# EAGLE design Glider (EAGLE 7.1.0)
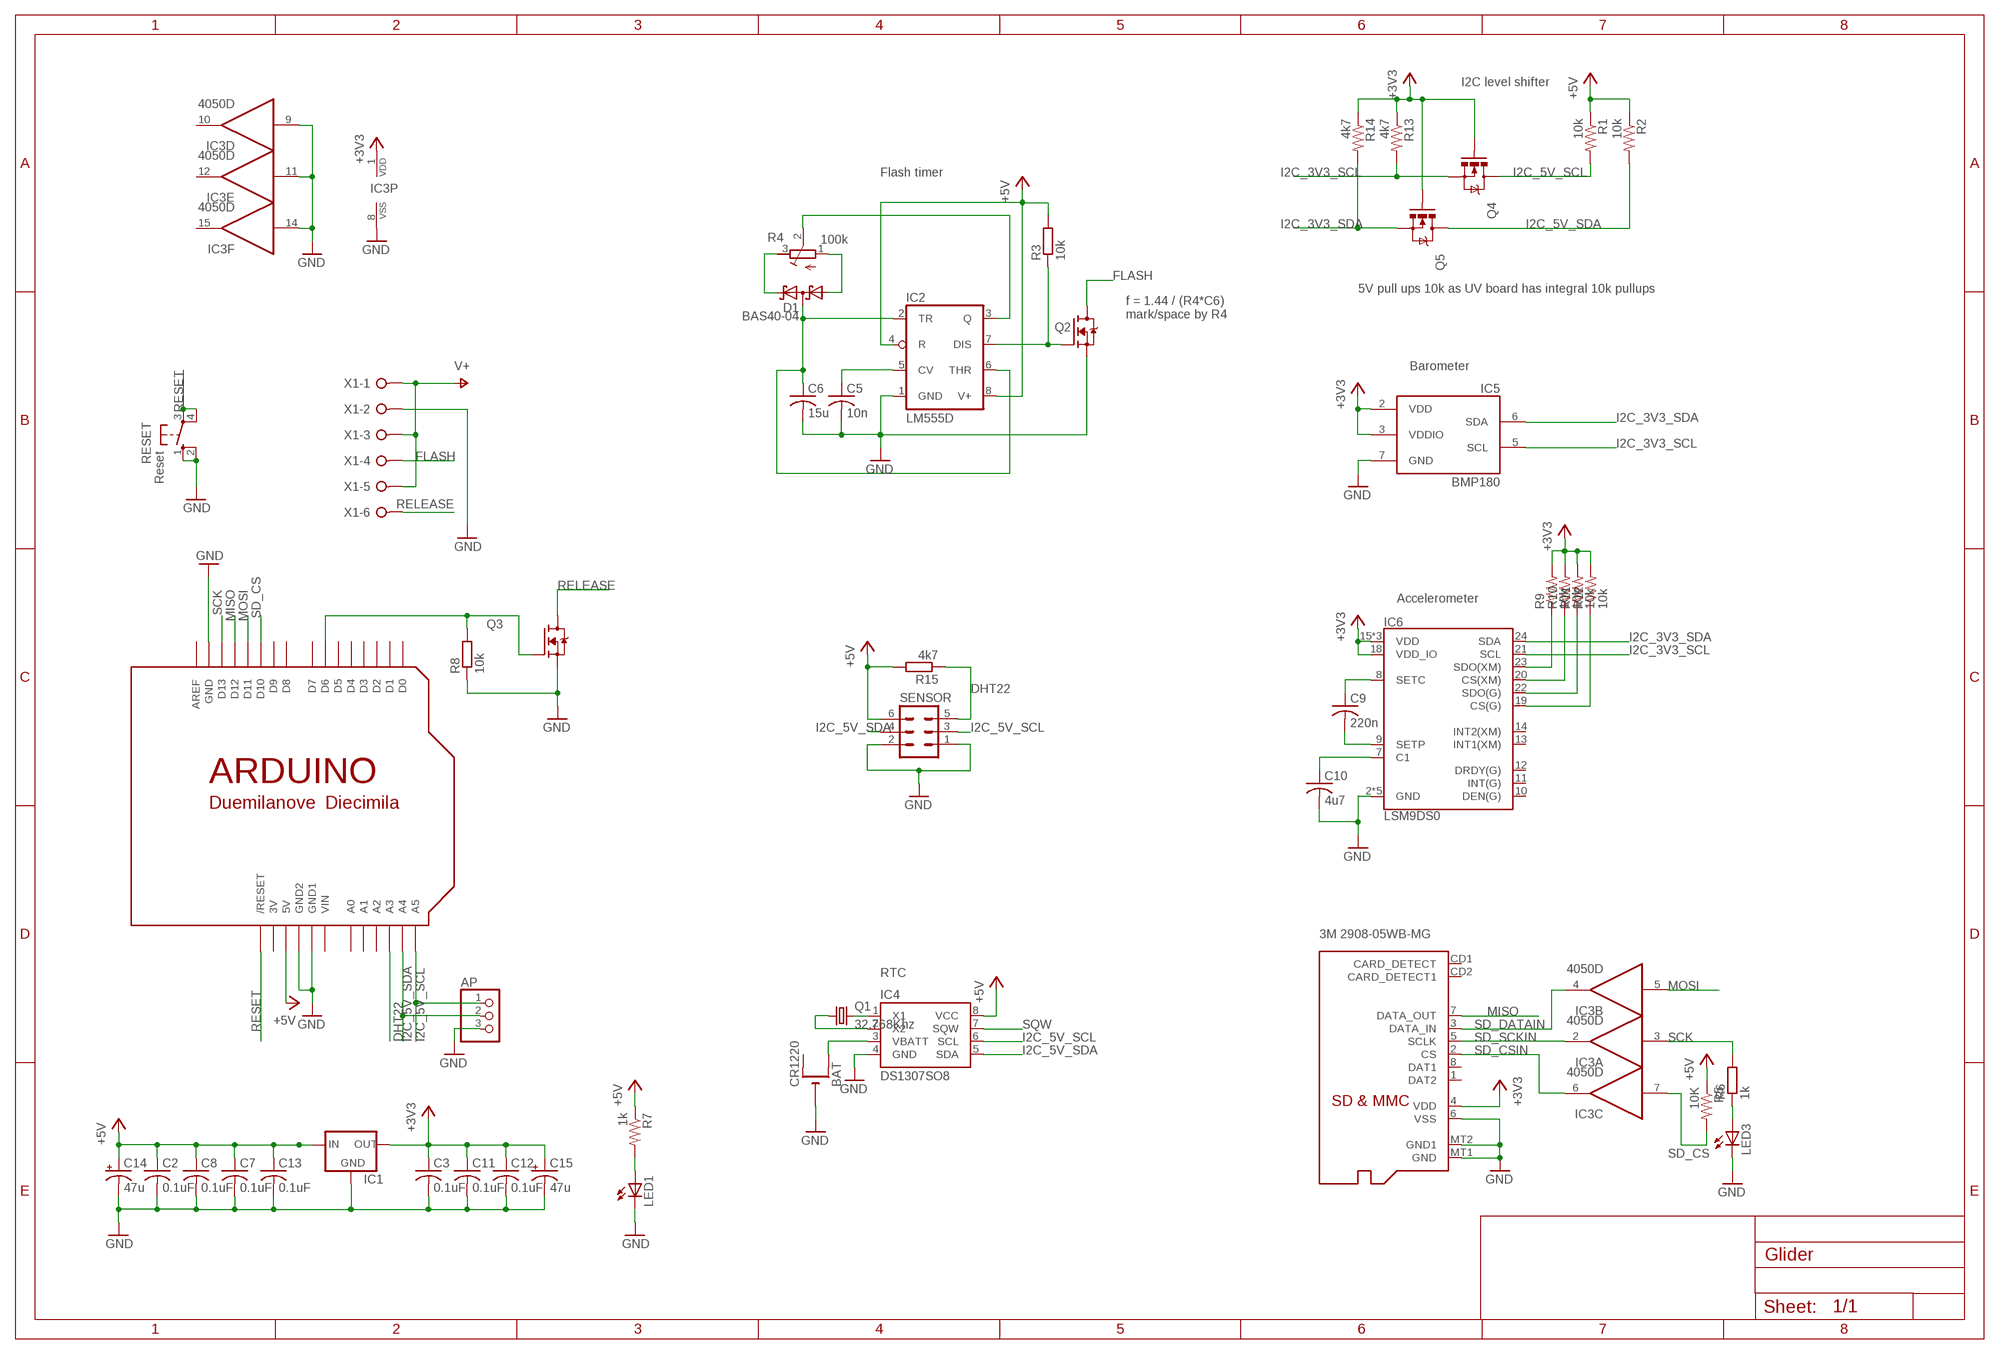
[diagram p0: schematic, sheet 1]

## Parts
AP  PINHD-1X3  [1X03]
BAT  CR1220  CR1220THM  [CR1220-THM]
C2  0.1uF  C-USC0805  [C0805]
C3  0.1uF  C-USC0805  [C0805]
C5  10n  C-USC0805  [C0805]
C6  15u  C-USC0805  [C0805]
C7  0.1uF  C-USC0805  [C0805]
C8  0.1uF  C-USC0805  [C0805]
C9  220n  C-USC0603  [C0603]
C10  4u7  C-USC0603  [C0603]
C11  0.1uF  C-USC0805  [C0805]
C12  0.1uF  C-USC0805  [C0805]
C13  0.1uF  C-USC0805  [C0805]
C14  47u  CPOL-USSMCB  [SMC_B]
C15  47u  CPOL-USSMCB  [SMC_B]
D1  BAS40-04  [SOT23]
IC1  MCP1700TT  [SOT-23]
IC2  LM555D  [SO08]
IC3  4050D  [SO16]
IC4  DS1307SO8  [SO08]
IC5  BMP180  [BMP180]
IC6  LSM9DS0  [LGA-24]
LED1  LEDCHIPLED_0805  [CHIPLED_0805]
LED3  LEDCHIPLED_0805  [CHIPLED_0805]
Q1  32.768Khz  CRYSTALTC38H  [TC38H]
Q2  NTD20N06LT4G  [TO252]
Q3  NTD20N06LT4G  [TO252]
Q4  MOSFET-NCHANNELBSS123LT1G  [SOT23-3]
Q5  MOSFET-NCHANNELBSS123LT1G  [SOT23-3]
R1  10k  R-US_R0805  [R0805]
R2  10k  R-US_R0805  [R0805]
R3  10k  R-EU_R0805  [R0805]
R4  100k  R-TRIMM3214W  [RTRIM3214W]
R5  10K  R-US_R0805  [R0805]
R6  1k  R-EU_R0805  [R0805]
R7  1k  R-US_R0805  [R0805]
R8  10k  R-EU_R0805  [R0805]
R9  10k  R-US_R0805  [R0805]
R10  10k  R-US_R0805  [R0805]
R11  10k  R-US_R0805  [R0805]
R12  10k  R-US_R0805  [R0805]
R13  4k7  R-US_R0805  [R0805]
R14  4k7  R-US_R0805  [R0805]
R15  4k7  R-EU_R0805  [R0805]
RESET  Reset  10-XX  [B3F-10XX]
SD  MICROSD  [MICROSD]
SENSOR  ML6  [ML6]
U$1  ARDUINODUEMILANOVE-NOHOLES  [ARDUINO-NOHOLE]
X1  W237-06P  [W237-6P]

## Nets
+3V3: C3.1 C11.1 C12.1 C15.+ IC1.2(OUT) IC3.1(P:VDD) IC5.2(VDD) IC5.3(VDDIO) IC6.15(VDD) IC6.16(VDD) IC6.17(VDD) IC6.18(VDD_IO) Q4.1(G) Q5.1(G) R9.2 R10.2 R11.2 R12.2 R13.1 R14.1 SD.4(VDD)
+5V: C2.1 C7.1 C8.1 C13.1 C14.+ IC1.3(IN) IC2.4(R) IC2.8(V+) IC4.8(VCC) R1.1 R2.1 R3.2 R5.1 R7.1 R15.2 SENSOR.6 U$1.5V
DHT22: R15.1 SENSOR.5 U$1.A3
FLASH: Q2.4(D) X1.4
GND: AP.3 BAT.- C2.2 C3.2 C5.2 C6.2 C7.2 C8.2 C10.2 C11.2 C12.2 C13.2 C14.- C15.- IC1.1(GND) IC2.1(GND) IC3.8(P:VSS) IC3.9(D:I) IC3.11(E:I) IC3.14(F:I) IC4.4(GND) IC5.7(GND) IC6.2(GND) IC6.3(GND) IC6.4(GND) IC6.5(GND) IC6.6(GND) LED1.C LED3.C Q2.3(S) Q3.3(S) R8.1 RESET.1(S) RESET.2(S1) SD.6(VSS) SD.MT1(GND) SD.MT2(GND1) SENSOR.1 SENSOR.2 U$1.GND U$1.GND1 U$1.GND2 X1.2
I2C_3V3_SCL: IC5.5(SCL) IC6.21(SCL) Q4.2(S) R13.2
I2C_3V3_SDA: IC5.6(SDA) IC6.24(SDA) Q5.2(S) R14.2
I2C_5V_SCL: AP.1 IC4.6(SCL) Q4.3(D) R1.2 SENSOR.3 U$1.A5
I2C_5V_SDA: AP.2 IC4.5(SDA) Q5.3(D) R2.2 SENSOR.4 U$1.A4
MISO: SD.7(DATA_OUT) U$1.D12
MOSI: IC3.5(B:I) U$1.D11
N$1: BAT.+1(+) IC4.3(VBATT)
N$2: IC4.1(X1) Q1.2
N$3: IC4.2(X2) Q1.1
N$4: LED3.A R6.1
N$5: IC2.3(Q) R4.2(S)
N$6: LED1.A R7.2
N$7: D1.1(A1) R4.1(A)
N$8: D1.2(C2) R4.3(E)
N$9: C6.1 D1.3(C1A2) IC2.2(TR) IC2.6(THR)
N$10: C5.1 IC2.5(CV)
N$11: IC6.23(SDO(XM)) R9.1
N$12: IC2.7(DIS) Q2.1(G) R3.1
N$13: IC6.20(CS(XM)) R10.1
N$14: IC6.22(SDO(G)) R11.1
N$15: IC6.19(CS(G)) R12.1
N$16: C10.1 IC6.7(C1)
N$17: C9.1 IC6.8(SETC)
N$18: C9.2 IC6.9(SETP)
N$100: Q3.1(G) R8.2 U$1.D6
RELEASE: Q3.4(D) X1.6
RESET: RESET.3(P) RESET.4(P1) U$1.RESET(/RESET)
SCK: IC3.3(A:I) R6.2 U$1.D13
SD_CS: IC3.7(C:I) R5.2 U$1.D10
SD_CSIN: IC3.6(C:O) SD.2(CS)
SD_DATAIN: IC3.4(B:O) SD.3(DATA_IN)
SD_SCKIN: IC3.2(A:O) SD.5(SCLK)
SQW: IC4.7(SQW)
V+: X1.1 X1.3 X1.5
Unconnected: BAT.+2(+1) IC3.10(D:O) IC3.12(E:O) IC3.15(F:O) IC6.10(DEN(G)) IC6.11(INT(G)) IC6.12(DRDY(G)) IC6.13(INT1(XM)) IC6.14(INT2(XM)) SD.1(DAT2) SD.8(DAT1) SD.CD1(CARD_DETECT) SD.CD2(CARD_DETECT1) U$1.A0 U$1.A1 U$1.A2 U$1.AREF U$1.D0 U$1.D1 U$1.D2 U$1.D3 U$1.D4 U$1.D5 U$1.D7 U$1.D8 U$1.D9

## Notes on the sheet
- I2C level shifter
- Flash timer
- 5V pull ups 10k as UV board has integral 10k pullups
- f = 1.44 / (R4*C6)
  mark/space by R4
- Barometer
- Accelerometer
- 3M 2908-05WB-MG
- RTC

## Power pins joined to a net without a drawn wire
3V: U$1.3V
VIN: U$1.VIN

## Library data of the parts
AP = pinhead:PINHD-1X3: PIN HEADER
BAT = adafruit:CR1220: CR1216/CR1220/CR1225 12mm 3V lithium coin cell Great for battery packup. Both SMT and THM holders. Note the THM package has the ground pads on both sides of the PCB so that the masks are the same - this reduces the cost
C2 C3 C7 C8 C11-C13 = adafruit:C-US: CAPACITOR, American symbol
C5 C6 C9 C10 = rcl:C-US: CAPACITOR, American symbol
C14 C15 = rcl:CPOL-US: POLARIZED CAPACITOR, American symbol
D1 = diode:BAS40-04: Silicon Schottky Diodes General-purpose diode for high-speed switching
IC1 = AWJLEagleLib:MCP1700: Microchip MCP1700 positive regulator
IC2 = linear:*555: TIMER
IC3 = 40xx:4050: Hex non-inverting BUFFER
IC4 = SparkFun-FreqCtrl:DS1307: I2C real-time clock with battery backup.
IC5 = SparkFun-Sensors:BMP180: BOSCH BMP180 DIGITAL BAROMETRIC PRESSURE SENSOR Web page: http://www.bosch-sensortec.com/en/homepage/products_3/environmental_sensors_1/bmp180_1/bmp180 Datasheet: http://ae-bst.resource.bosch.com/media/products/dokumente/bmp180/BST-BMP180-DS000-09.pdf The BMP180 is the function compatible successor of the BMP085, a new generation of high precision digital pressure sensors for consumer applications. The ultra-low power, low voltage electronics of the BMP180 is optimized for use in mobile phones, PDAs, GPS navigation devices and outdoor equipment. With a low altitude noise of merely 0.25m at fast conversion time, the BMP180 offers superior performance. The I2C interface allows for easy system integration with a microcontroller. The BMP180 is based on piezo-resistive technology for EMC robustness, high accuracy and linearity as well as long term stability. Key features: - Temperature measurement included - I2C interface - Fully calibrated - Pb-free, halogen-free and RoHS compliant, - MSL 1 Basic specs: Pressure range: 300 to 1100hPa (+9000m to -500m relating to sea level) Supply voltage: 1.8 to 3.6V (VDD), 1.62V to 3.6V (VDDIO) Package: LGA package with metal lid Small footprint: 3.6mm x 3.8mm Super-flat: 0.93mm height Low power: 5μA at 1 sample / sec. in standard mode Low noise: 0.06hPa (0.5m) in ultra low power mode, 0.02hPa (0.17m) advanced resolution mode Typical applications: - Enhancement of GPS navigation (dead-reckoning, slope detection, etc.) - In- and out-door navigation - Leisure and sports - Weather forecast - Vertical velocity indication (rise/sink speed)
IC6 = SparkFun-DigitalIC:LSM9DS0: LSM9DS0 3D Accelerometer, 3D Gyroscope, 3D Magnetomter Features: 3 acceleration channels, 3 angular rate channels, 3 magnetic field channels ±2/±4/±6/±8/±16 g linear acceleration full scale ±2/±4/±8/±12 gauss magnetic full scale ±245/±500/±2000 dps angular rate full scale 16-bit data output SPI / I2C serial interfaces Analog supply voltage 2.4 V to 3.6 V Power-down mode / low-power mode Programmable interrupt generators Embedded self-test Embedded temperature sensor Embedded FIFO Position and motion detection functions Click/double-click recognition
LED1 LED3 = led:LED: LED OSRAM: - CHIPLED LG R971, LG N971, LY N971, LG Q971, LY Q971, LO R971, LY R971 LH N974, LH R974 LS Q976, LO Q976, LY Q976 LO Q996 - Hyper CHIPLED LW Q18S LB Q993, LB Q99A, LB R99A - SideLED LS A670, LO A670, LY A670, LG A670, LP A670 LB A673, LV A673, LT A673, LW A673 LH A674 LY A675 LS A676, LA A676, LO A676, LY A676, LW A676 LS A679, LY A679, LG A679 - Hyper Micro SIDELED® LS Y876, LA Y876, LO Y876, LY Y876 LT Y87S - SmartLED LW L88C, LW L88S LB L89C, LB L89S, LG L890 LS L89K, LO L89K, LY L89K LS L896, LA L896, LO L896, LY L896 - TOPLED LS T670, LO T670, LY T670, LG T670, LP T670 LSG T670, LSP T670, LSY T670, LOP T670, LYG T670 LG T671, LOG T671, LSG T671 LB T673, LV T673, LT T673, LW T673 LH T674 LS T676, LA T676, LO T676, LY T676, LB T676, LH T676, LSB T676, LW T676 LB T67C, LV T67C, LT T67C, LS T67K, LO T67K, LY T67K, LW E67C LS E67B, LA E67B, LO E67B, LY E67B, LB E67C, LV E67C, LT E67C LW T67C LS T679, LY T679, LG T679 LS T770, LO T770, LY T770, LG T770, LP T770 LB T773, LV T773, LT T773, LW T773 LH T774 LS E675, LA E675, LY E675, LS T675 LS T776, LA T776, LO T776, LY T776, LB T776 LHGB T686 LT T68C, LB T68C - Hyper Mini TOPLED® LB M676 - Mini TOPLED Santana® LG M470 LS M47K, LO M47K, LY M47K Source: http://www.osram.convergy.de LUXEON: - LUMILED® LXK2-PW12-R00, LXK2-PW12-S00, LXK2-PW14-U00, LXK2-PW14-V00 LXK2-PM12-R00, LXK2-PM12-S00, LXK2-PM14-U00 LXK2-PE12-Q00, LXK2-PE12-R00, LXK2-PE12-S00, LXK2-PE14-T00, LXK2-PE14-U00 LXK2-PB12-K00, LXK2-PB12-L00, LXK2-PB12-M00, LXK2-PB14-N00, LXK2-PB14-P00, LXK2-PB14-Q00 LXK2-PR12-L00, LXK2-PR12-M00, LXK2-PR14-Q00, LXK2-PR14-R00 LXK2-PD12-Q00, LXK2-PD12-R00, LXK2-PD12-S00 LXK2-PH12-R00, LXK2-PH12-S00 LXK2-PL12-P00, LXK2-PL12-Q00, LXK2-PL12-R00 Source: www.luxeon.com KINGBRIGHT: KA-3528ASYC Source: www.kingbright.com
Q1 = crystal:CRYSTAL: CRYSTAL
Q2 Q3 = HAAG:NTD20N06LT4G: On Semiconductor NTD20N06LT4G N-MOSFET
Q4 Q5 = SparkFun-DiscreteSemi:MOSFET-NCHANNEL: Common NMOSFET Parts MFG P/N Store ID Prod ID FDD8780 TRANS-09984 SI7820DN TRANS-11055 FDS6630A IC-08089 2N7002PW TRANS-11151 FQP30N06L COM-10213 TRANS-10060 BSS123LT1G TRANS-08345 BSS138 TRANS-00830 BS170 2N7000; PROD_ID: TRANS-08345
R1 R2 R5 R7 R13 R14 = adafruit:R-US_: RESISTOR, American symbol
R3 R6 R8 R15 = rcl:R-EU_: RESISTOR, European symbol
R4 = rcl:R-TRIMM: Trimm resistor
R9-R12 = rcl:R-US_: RESISTOR, American symbol
RESET = switch-omron:10-XX: OMRON SWITCH
SD = adafruit:MICROSD: Micro-SD / Transflash card holder with SPI pinout For the 3M # 2908-05WB-MG and/or 4UCON #19656 push-push type
SENSOR = con-harting-ml:ML6: HARTING; OC_FARNELL: unknown; OC_NEWARK: unknown
U$1 = adafruit:ARDUINO: Arduino Diecimila/Duemilanove Make a shield with ease, this package has all the named pins as well as the two mounting drill holes and an outline of the USB and DC power connector. The outline is on the DIMENSION layer, so if your board house uses it they will cut the outline to match. http://www.ladyada.net/library/pcb/eaglelibrary.html
X1 = con-wago-508:W237-06P: WAGO SREW CLAMP; OC_FARNELL: unknown; OC_NEWARK: unknown

## Board
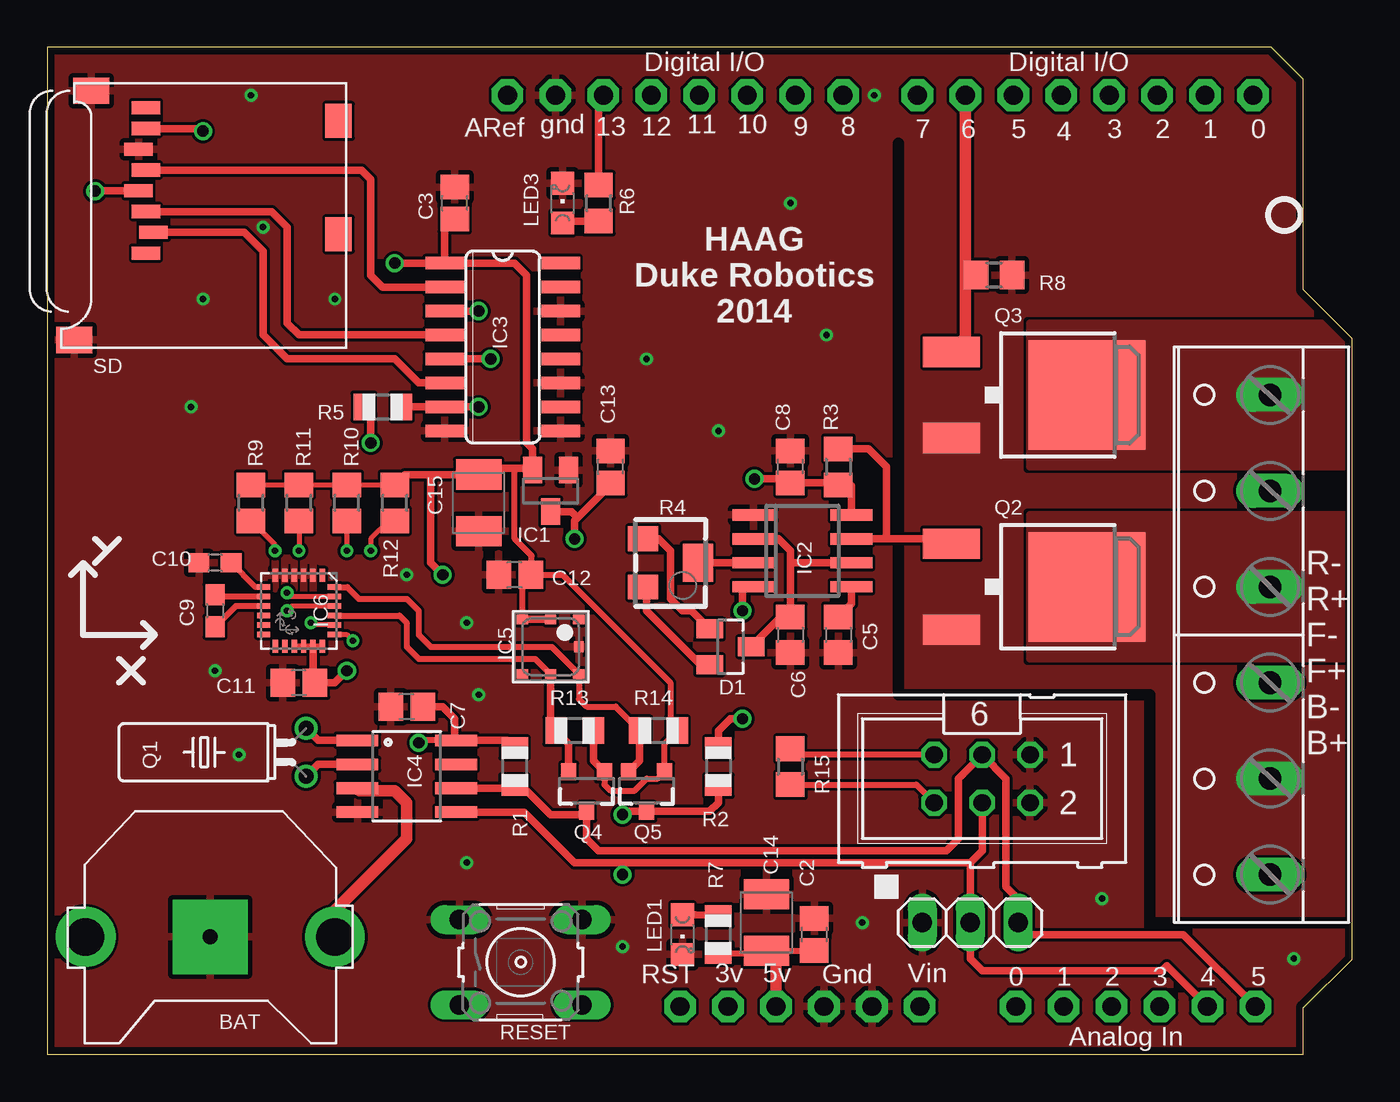
[diagram p1: board, top side]
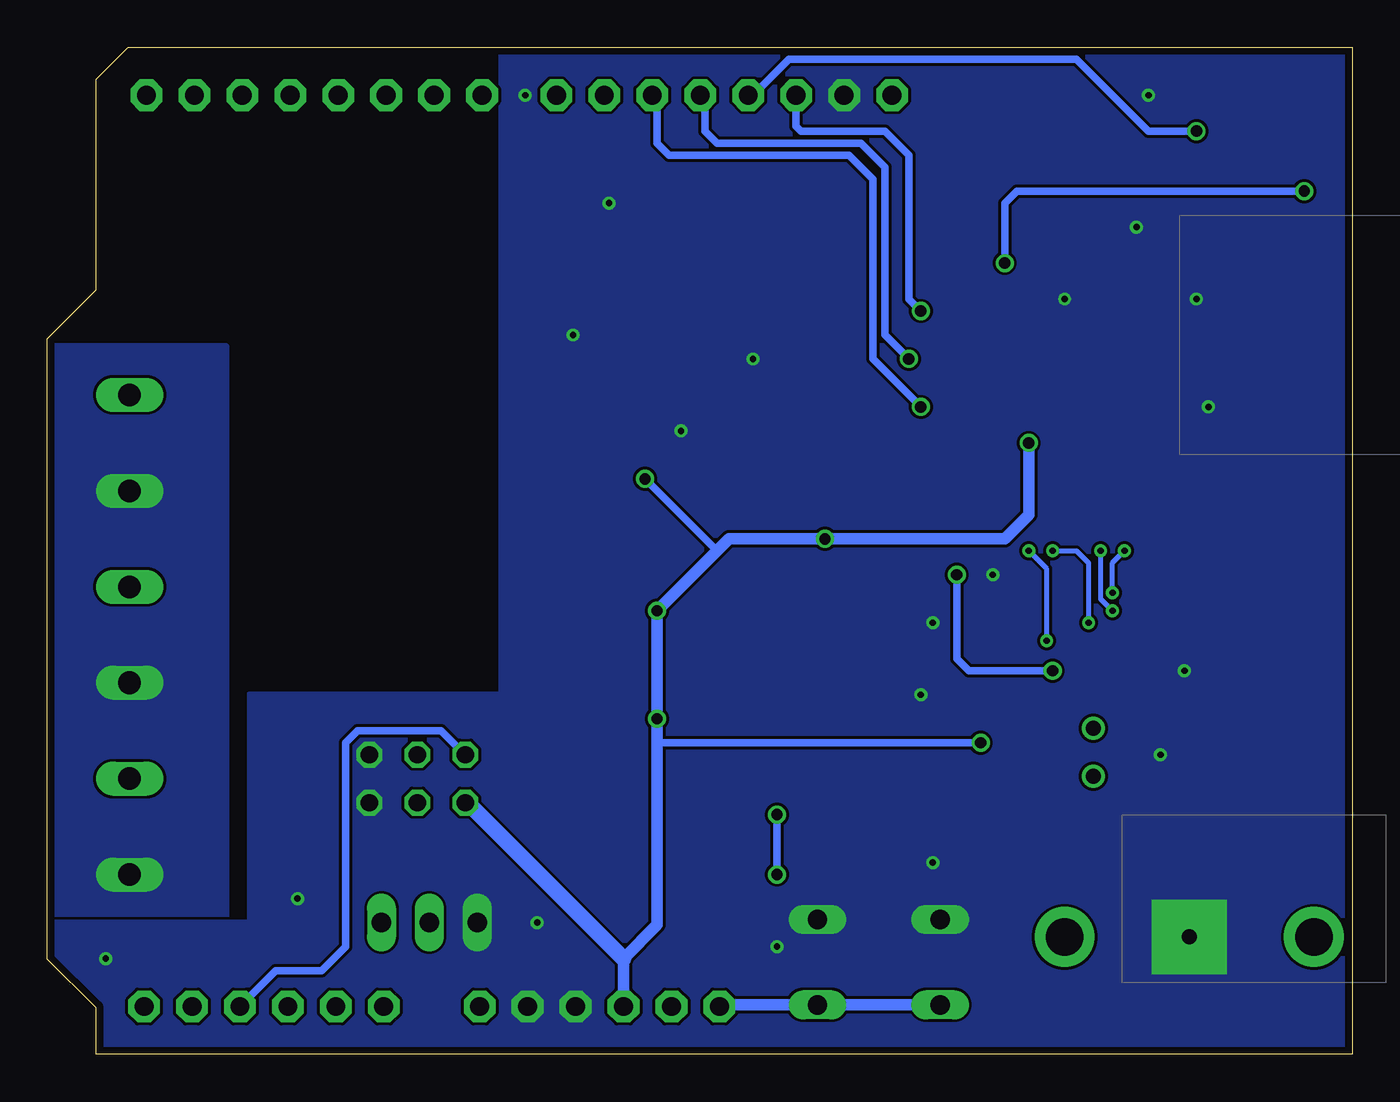
[diagram p2: board, bottom side, seen from below]

Size 69.14 x 53.34 mm. Coordinates in mm from the lower left corner, seen from the top.
Outline: 69.14,5.09 69.14,5.1
Copper layers (1*16): Top 0.0356mm / dielectric 1.5011mm / Bottom 0.0356mm
Design rules "LaenPCBOrder": minimum track width 6mil, minimum drill 13mil, track to track 6mil, track to pad 6mil, pad to pad 6mil, via to via 6mil, smd to smd 6mil, copper to edge 15mil, drill to drill 6mil, minimum pad ring 7mil, minimum via ring 7mil, stop-mask expansion 4mil, vias tented up to drill 0mil, thermal gap 10mil
tRestrict: 4 lines

### Footprints (pad centres in the part's own frame; a part is rotated, then mirrored left to right if it is on the bottom)
1X03 = drill 1.016 long: 1 -2.54,0; 2 0,0; 3 2.54,0
CR1220-THM = drill 2 pad 3.175: +1 -6.604,0; +2 6.604,0 | drill 0.8 pad 3.962 square: - 0,0
C0805 = smd 1.3 x 1.5: 1 -0.85,0; 2 0.85,0
C0805' = smd 1.3 x 1.5: 1 -0.95,0; 2 0.95,0
C0603 = smd 1.1 x 1: 1 -0.85,0; 2 0.85,0
SMC_B = smd 1.6 x 2.4: + -1.5,0; - 1.5,0
SOT23 = smd 1 x 1.4: 1 -0.95,-1.1; 2 0.95,-1.1; 3 0,1.1
SOT-23 = smd 1 x 1.4: 1 -0.95,-1.1; 2 0.95,-1.1; 3 0,1.1
SO08 = smd 0.6 x 2.2: 1 -1.905,-2.6; 2 -0.635,-2.6; 3 0.635,-2.6; 4 1.905,-2.6; 5 1.905,2.6; 6 0.635,2.6; 7 -0.635,2.6; 8 -1.905,2.6
SO16 = smd 0.66 x 2.032: 1 -4.445,-3.073; 2 -3.175,-3.073; 3 -1.905,-3.073; 4 -0.635,-3.073; 5 0.635,-3.073; 6 1.905,-3.073; 7 3.175,-3.073; 8 4.445,-3.073; 9 4.445,3.073; 10 3.175,3.073; 11 1.905,3.073; 12 0.635,3.073; 13 -0.635,3.073; 14 -1.905,3.073; 15 -3.175,3.073; 16 -4.445,3.073
SO08' = smd 0.61 x 2.21: 1 -1.905,-2.616; 2 -0.635,-2.616; 3 0.635,-2.616; 4 1.905,-2.616; 5 1.905,2.616; 6 0.635,2.616; 7 -0.635,2.616; 8 -1.905,2.616
BMP180 = smd 0.6 x 0.5: 1 1.5,1.45; 2 0,1.45; 3 -1.5,1.45; 4 -1.5,-1.45; 5 0,-1.45; 6 1.5,-1.45 | smd 0.5 x 0.6: 7 1.5,0
LGA-24 = smd 0.7 x 0.29: 1 -1.875,1.25; 2 -1.875,0.75; 3 -1.875,0.25; 4 -1.875,-0.25; 5 -1.875,-0.75; 6 -1.875,-1.25; 13 1.875,-1.25; 14 1.875,-0.75; 15 1.875,-0.25; 16 1.875,0.25; 17 1.875,0.75; 18 1.875,1.25 | smd 0.29 x 0.7: 7 -1.25,-1.875; 8 -0.75,-1.875; 9 -0.25,-1.875; 10 0.25,-1.875; 11 0.75,-1.875; 12 1.25,-1.875; 19 1.25,1.875; 20 0.75,1.875; 21 0.25,1.875; 22 -0.25,1.875; 23 -0.75,1.875; 24 -1.25,1.875
CHIPLED_0805 = smd 1.2 x 1.2: A 0,-1.05; C 0,1.05
TC38H = drill 0.813: 1 -1.27,0; 2 1.27,0
TO252 = smd 1.6 x 3: 1 -2.28,-6.07; 3 2.28,-6.07 | smd 5.8 x 6.2: 4 0,1.11
SOT23-3 = smd 0.8 x 0.9: 1 -0.95,-1; 2 0.95,-1; 3 0,1.1
R0805 = smd 1.1 x 1.4: 1 -1,0; 2 1,0
R0805' = smd 1.3 x 1.5: 1 -0.95,0; 2 0.95,0
RTRIM3214W = smd 1.3 x 1.6: 1 -1.275,-1.45; 3 1.275,-1.45 | smd 2 x 1.6: 2 0,1.45
B3F-10XX = drill 1.016 long: 1 -3.251,2.261; 2 3.251,2.261; 3 -3.251,-2.261; 4 3.251,-2.261
MICROSD = smd 0.7 x 1.5: 1 9,-10.64; 2 7.9,-10.24; 3 6.8,-10.64; 4 5.7,-11.04; 5 4.6,-10.64; 6 3.5,-11.04; 7 2.4,-10.64; 8 1.3,-10.64 | smd 1.8 x 1.4: CD1 2,-0.44; CD2 8,-0.44 | smd 1.4 x 1.9: MT1 0.4,-13.54; MT2 13.6,-14.44
ML6 = drill 0.914 octagon: 1 -2.54,-1.27; 2 -2.54,1.27; 3 0,-1.27; 4 0,1.27; 5 2.54,-1.27; 6 2.54,1.27
ARDUINO-NOHOLE = drill 1 pad 1.676 octagon: 3V 36.068,2.54; 5V 38.608,2.54; A0 51.308,2.54; A1 53.848,2.54; A2 56.388,2.54; A3 58.928,2.54; A4 61.468,2.54; A5 64.008,2.54; AREF 24.384,50.8; D0 63.881,50.8; D1 61.341,50.8; D2 58.801,50.8; D3 56.261,50.8; D4 53.721,50.8; D5 51.181,50.8; D6 48.641,50.8; D7 46.101,50.8; D8 42.164,50.8; D9 39.624,50.8; D10 37.084,50.8; D11 34.544,50.8; D12 32.004,50.8; D13 29.464,50.8; GND 26.924,50.8; GND1 43.688,2.54; GND2 41.148,2.54; RESET 33.528,2.54; VIN 46.228,2.54
W237-6P = drill 1.194 long: 1 -12.7,-0.635; 2 -7.62,-0.635; 3 -2.54,-0.635; 4 2.54,-0.635; 5 7.62,-0.635; 6 12.7,-0.635

### Placement (x,y rotation side)
AP  48.9,6.99 180 top
BAT  8.64,6.22 180 top
C2  40.64,6.35 90 top
C3  21.59,45.09 90 top
C5  10n  [C0805']  41.91,22.23 270 top
C6  15u  [C0805']  39.37,22.23 270 top
C7  19.05,18.41 180 top
C8  39.37,31.11 90 top
C9  8.89,23.5 270 top
C10  8.89,26.04 180 top
C11  13.34,19.68 180 top
C12  24.77,25.4 180 top
C13  29.84,31.11 90 top
C14  38.1,6.99 90 top
C15  22.86,29.21 270 top
D1  36.2,21.59 270 top
IC1  26.67,29.84 180 top
IC2  40.01,26.67 270 top
IC3  24.13,37.47 270 top
IC4  DS1307SO8  [SO08']  19.05,14.73 270 top
IC5  26.67,21.59 0 top
IC6  13.34,23.5 270 top
LED1  33.66,6.35 180 top
LED3  27.3,45.09 0 top
Q1  13.72,16 90 top
Q2  53.98,24.77 270 top
Q3  53.98,34.92 270 top
Q4  28.57,13.97 180 top
Q5  31.75,13.97 180 top
R1  24.77,15.24 270 top
R2  35.56,15.24 270 top
R3  10k  [R0805']  41.91,31.11 270 top
R4  33.02,26.04 270 top
R5  17.78,34.29 0 top
R6  1k  [R0805']  29.21,45.09 90 top
R7  35.56,6.35 90 top
R8  10k  [R0805']  50.16,41.27 180 top
R9  10k  [R0805']  10.79,29.21 90 top
R10  10k  [R0805']  15.88,29.21 90 top
R11  10k  [R0805']  13.34,29.21 90 top
R12  10k  [R0805']  18.41,29.21 90 top
R13  27.94,17.14 180 top
R14  32.38,17.14 180 top
R15  4k7  [R0805']  39.37,15.24 270 top
RESET  25.09,4.88 0 top
SD  15.88,51.44 270 top
SENSOR  49.53,14.61 180 top
U$1  0,0 0 top
X1  64.14,22.23 90 top

### Tracks (layer width: path | path; a pad name or v marks a point on that pad's centre or on a via)
+3V3  (via drill 0.6)
  Top 0.254: R9.2 R11.2 R10.2 R12.2
  Top 0.305: Q4.1 29.52,14.29 29.84,13.97 31.11,13.97 31.75,14.61 32.34,14.61 Q5.1 32.7,16.46 R14.1 33.02,17.51 33.02,19.68 27.3,25.4 C12.1 | IC5.3 25.18,23.05 25.18,24.97 C12.1 | C12.1 25.67,25.45 25.67,26.4 24.77,27.3 24.77,31.05 | IC6.15 IC6.16 IC6.17 IC6.18
  Top 0.406: 21.57,44.23 21.06,43.6 IC3.1 | IC3.1 24.77,41.91 25.4,41.27 25.4,32.38 25.72,32.06 IC1.2 25.62,31.05 24.77,31.05 23.2,31.05 C15.+ 20.32,30.71 | SD.4 2.56,45.73 v2.54,45.72 | IC3.1 v18.41,41.91 | R13.1 28.94,15.55 Q4.1 | IC5.3 IC5.2 | IC6.17 14.09,19.79 C11.1 15.24,19.68 v15.88,20.32 | 20.32,30.71 18.96,30.71 R12.2 | v20.95,25.4 20.32,26.04 20.32,30.71
  Top 0.61: C3.1 21.57,44.23
  Bottom 0.406: v2.54,45.72 17.78,45.72 18.41,45.09 v18.41,41.91 | v15.88,20.32 20.32,20.32 20.95,20.95 v20.95,25.4
+5V  (via drill 0.6)
  Top 0.305: IC4.8 19.81,16.64 v19.68,16.51 | R15.2 46.03,14.29 SENSOR.6 | R7.1 37.97,5.35 C14.+ | C14.+ 40.62,5.49 C2.1 | C14.+ 40.64,5.49 40.64,5.08
  Top 0.406: C8.1 42.45,30.27 R3.2 42.6,30.11 IC2.8 | v27.94,27.3 27.94,28.27 28.09,28.43 | v36.83,23.5 36.83,24.77 IC2.4 | C8.1 39.16,30.27 | C7.1 20.95,18.41 21.59,17.78 21.59,16.71 IC4.8 24.37,16.64 R1.1 | v17.14,32.38 17.14,33.92 R5.1 | C13.1 29.84,30.18 28.09,28.43 | R2.1 35.56,17.14 36.2,17.78 v36.83,17.78 | v37.47,30.48 39.16,30.48 C8.1 | IC1.3 27.77,28.75 28.09,28.43
  Top 0.61: C14.+ 38.61,5.49 U$1.5V
  Bottom 0.406: 36.83,16.51 v19.68,16.51 | v37.47,30.48 33.66,26.67
  Bottom 0.61: SENSOR.6 46.86,13.34 | U$1.5V 38.61,5.08 36.83,6.86 36.83,16.51 v36.83,17.78 v36.83,23.5 33.66,26.67 33.02,27.3 v27.94,27.3 18.41,27.3 17.14,28.57 v17.14,32.38
  Bottom 0.813: 46.86,13.34 38.61,5.08
DHT22
  Top 0.305: SENSOR.5 39.37,15.88 R15.1
  Bottom 0.406: SENSOR.5 48.26,17.14 52.7,17.14 53.34,16.51 53.34,5.71 54.61,4.45 57.02,4.45 U$1.A3
FLASH
  pour Top (no thermals): 52.07,28.57 69.22,28.57 69.22,20.95 52.07,20.95
GND  (via drill 0.33 pad 0.51)
  Bottom 0.406: U$1.GND 26.8,50.67 26.92,50.55
  other vias: 22.23,22.86 19.05,25.4 8.89,20.32 22.86,19.05 35.56,33.02 31.75,36.83 41.27,38.1 39.37,45.09 7.62,34.29 8.26,40.01 15.24,40.01 10.79,50.8 43.81,50.8 22.23,10.16 10.16,15.88 43.18,6.99 55.88,8.26 30.48,5.71 11.43,43.81 66.04,5.08
  pour Top (rank 2): 69.85,-0.13 69.47,20.32 69.22,53.34 0.13,53.85 0.25,0
  pour Top (no thermals): 62.23,16.51 67.31,16.51 67.31,12.7 62.23,12.7
  pour Top (no thermals): 45.72,24.13 50.8,24.13 50.8,20.32 45.72,20.32
  pour Top (no thermals): 45.72,34.29 50.8,34.29 50.8,30.48 45.72,30.48
  pour Bottom (no thermals): 0,53.34 45.09,53.34 45.09,19.05 58.42,19.05 58.42,6.99 69.22,6.99 69.22,0 0,0
I2C_3V3_SCL
  Top 0.305: IC6.21 18.66,23.25 19.05,22.86 19.05,21.59 19.68,20.95 25.86,20.95 IC5.5
  Top 0.406: Q4.2 27.62,16.46 R13.2 26.67,17.41 IC5.5
I2C_3V3_SDA
  Top 0.305: IC6.24 15.89,24.75 16.51,24.13 19.05,24.13 19.68,23.5 19.68,22.23 20.32,21.59 26.72,21.59 IC5.6 28.17,18.82 28.57,18.41 30.11,18.41 R14.2
  Top 0.406: Q5.2 31.39,15.55 R14.2 31.11,17.41
I2C_5V_SCL
  Top 0.406: U$1.A5 60.2,6.35 52.07,6.35 AP.1 51.44,8.26 50.8,8.89 50.8,14.61 SENSOR.3 48.26,14.61 48.26,11.43 47.62,10.79 29.21,10.79 28.57,11.43 Q4.3 28.41,12.7 26.67,12.7 25.13,14.24 R1.2 24.62,14.1 IC4.6 21.54,13.97
I2C_5V_SDA  (via drill 0.6)
  Top 0.406: SENSOR.4 49.53,10.79 48.9,10.16 | U$1.A4 59.31,4.7 59.05,4.45 49.53,4.45 48.9,5.08 AP.2 48.9,10.16 | 30.48,10.16 48.9,10.16 | v30.48,12.7 30.65,12.87 Q5.3 35.09,12.87 35.56,13.34 R2.2 | v30.48,9.53 30.48,10.16 | IC4.5 25.27,12.83 27.94,10.16 30.48,10.16
  Bottom 0.406: v30.48,12.7 v30.48,9.53
MISO  (via drill 0.6)
  Top 0.406: SD.7 8.12,49.03 v8.26,48.9
  Bottom 0.406: U$1.D12 31.75,50.8 29.84,52.7 14.61,52.7 10.79,48.9 v8.26,48.9
MOSI  (via drill 0.6)
  Top 0.406: IC3.5 v23.5,36.83
  Bottom 0.406: v23.5,36.83 24.77,38.1 24.77,46.99 26.04,48.26 33.66,48.26 34.29,48.9 34.29,50.55 U$1.D11
N$1
  Top 0.61: BAT.+1 15.24,7.62 19.05,11.43 19.05,13.34 18.41,13.97 16.56,13.97 IC4.3
N$2
  Top 0.406: IC4.1 14.35,16.64 Q1.2
N$3
  Top 0.406: IC4.2 14.35,15.37 Q1.1
N$4
  Top 0.406: R6.1 27.2,44.13 LED3.A
N$5
  Top 0.406: R4.2 IC2.3
N$6
  Top 0.406: R7.2 34.34,7.4 LED1.A
N$7
  Top 0.406: R4.1 32.38,27.31 33.02,26.67 33.02,24.13 33.66,23.5 34.14,23.5 D1.1
N$8
  Top 0.406: D1.2 34.6,20.64 31.75,23.5 31.75,24.58 R4.3
N$9
  Top 0.406: 39.37,26.04 IC2.6 | 39.37,26.04 C6.1 38.88,23.18 D1.3 | IC2.2 38.73,27.3 39.37,26.67 39.37,26.04
N$10
  Top 0.406: IC2.5 42.6,23.87 C5.1
N$11  (via drill 0.33, 0.33 pad 0.51)
  Top 0.254: IC6.23 12.9,24.25 v12.7,24.45 | v12.06,26.67 12.06,26.99 R9.1
  Bottom 0.254: v12.7,24.45 12.7,26.04 v12.06,26.67
N$12
  Top 0.406: IC2.7 44.45,27.3 | 44.45,27.3 47.65,27.3 Q2.1 | R3.1 43.5,32.06 44.45,31.11 44.45,27.3
N$13  (via drill 0.33, 0.33 pad 0.51)
  Top 0.254: IC6.20 14.09,22.75 v13.97,22.86 | R10.1 v15.88,26.67
  Bottom 0.254: v15.88,26.67 14.61,26.67 13.97,26.04 v13.97,22.86
N$14  (via drill 0.33, 0.33 pad 0.51)
  Top 0.254: IC6.22 12.95,23.75 v12.7,23.5 | R11.1 v13.34,26.67
  Bottom 0.254: v13.34,26.67 13.34,24.13 v12.7,23.5
N$15  (via drill 0.33, 0.33 pad 0.51)
  Top 0.254: IC6.19 15.86,22.25 v16.19,21.91 | R12.1 18.1,28.26 17.14,27.3 v17.14,26.67
  Bottom 0.254: v16.19,21.91 16.19,25.72 v17.14,26.67
N$16
  Top 0.305: IC6.7 11.03,24.75 C10.1
N$17
  Top 0.305: IC6.8 8.99,24.25 C9.1
N$18
  Top 0.305: IC6.9 9.99,23.75 C9.2
N$100
  Top 0.61: U$1.D6 48.64,41.27 | 48.64,41.27 48.64,37.94 Q3.1 | R8.2 48.64,41.27
RELEASE
  pour Top (no thermals): 52.07,38.73 69.22,38.73 69.22,31.11 52.07,31.11
RESET
  Bottom 0.61: RESET.3 RESET.4 33.53,2.62 U$1.RESET
SCK  (via drill 0.6)
  Top 0.406: IC3.3 v22.86,39.37 | R6.2 29.21,50.55 U$1.D13
  Bottom 0.406: v22.86,39.37 23.5,40.01 23.5,47.62 24.77,48.9 29.21,48.9 29.46,49.15 U$1.D13
SD_CS  (via drill 0.6)
  Top 0.406: v22.86,34.29 IC3.7 R5.2
  Bottom 0.406: v22.86,34.29 25.4,36.83 25.4,46.35 26.67,47.62 36.2,47.62 36.83,48.26 36.83,50.55 U$1.D10
SD_CSIN
  Top 0.406: SD.2 10.44,43.53 11.43,42.55 11.43,38.1 12.7,36.83 18.41,36.83 19.68,35.56 IC3.6
SD_DATAIN
  Top 0.406: SD.3 11.88,44.63 12.7,43.81 12.7,38.73 13.34,38.1 IC3.4
SD_SCKIN
  Top 0.406: SD.5 16.66,46.84 17.14,46.35 17.14,41.27 17.78,40.64 IC3.2
V+
  pour Bottom (rank 2, no thermals): 59.69,37.47 69.22,37.47 69.22,6.99 59.69,6.99

### Text on the board
tPlace: R- / R+ / F- / F+ / B- / B+
tNames: HAAG / Duke Robotics / 2014